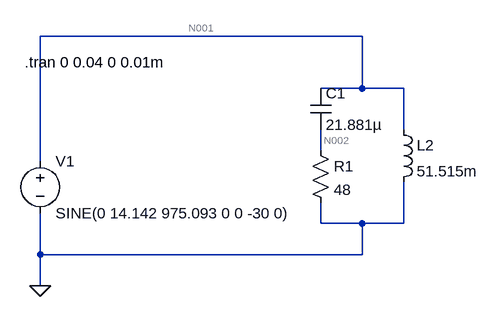
[diagram p0: schematic lab3_res_and_cap.asc]
lab3_res_and_cap.asc, the LTspice schematic file:
Version 4.1
SHEET 1 1420 680
WIRE 832 64 336 64
WIRE 832 144 832 64
WIRE 832 144 768 144
WIRE 896 144 832 144
WIRE 896 208 896 144
WIRE 768 240 768 208
WIRE 336 256 336 64
WIRE 768 352 768 320
WIRE 832 352 768 352
WIRE 896 352 896 288
WIRE 896 352 832 352
WIRE 336 400 336 336
WIRE 832 400 832 352
WIRE 832 400 336 400
WIRE 336 448 336 400
FLAG 336 448 0
SYMBOL voltage 336 240 R0
SYMATTR InstName V1
SYMATTR Value SINE(0 14.142 975.093 0 0 -30 0)
SYMBOL ind 880 192 R0
SYMATTR InstName L2
SYMATTR Value 51.515m
SYMATTR SpiceLine Rser=15
SYMBOL res 752 224 R0
SYMATTR InstName R1
SYMATTR Value 48
SYMBOL cap 752 144 R0
SYMATTR InstName C1
SYMATTR Value 21.881µ
TEXT 312 104 Left 2 !.tran 0 0.04 0 0.01m

The netlist it stands for:
* lab3_res_and_cap.asc
V1 N001 0 SINE(0 14.142 975.093 0 0 -30 0)
L2 N001 0 51.515m Rser=15
R1 N002 0 48
C1 N001 N002 21.881µ
.tran 0 0.04 0 0.01m
.backanno
.end

* Results of the author's LTspice run, read from the files saved beside the schematic
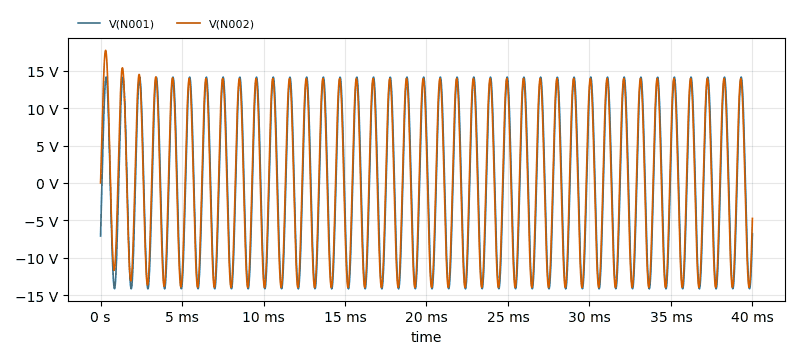
[diagram p1: Transient Analysis of lab3_res_and_cap.asc, plotted from the saved traces]
* Transient Analysis, 1 run:
*   V(N001): min -14.14 V, max 14.14 V, average -5.477 µV, rms 10 V, last -6.783 V
*   V(N002): min -13.97 V, max 17.72 V, average 132.6 mV, rms 9.923 V, last -4.741 V